# Altium project FC_small.PrjPcb
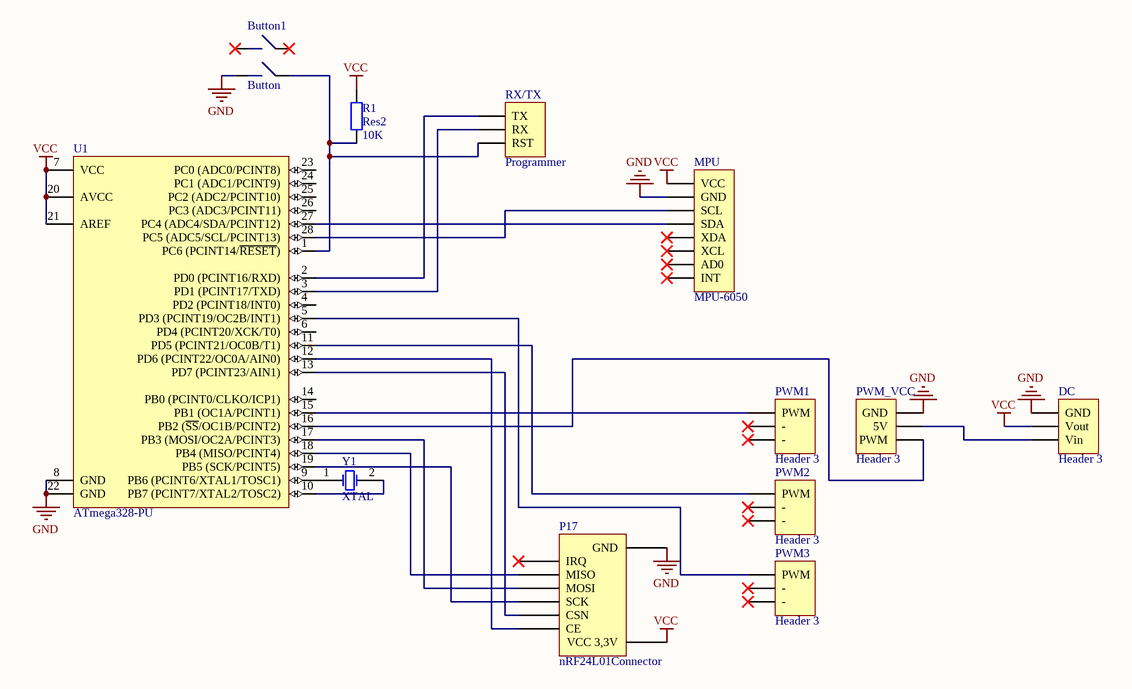
[diagram p0: FC_small.SchDoc]
1 sheet, 12 parts. Net scope: global (net labels, ports and power ports of the same name join across sheets).
Board file: PCB_FC_small.PcbDoc

## Sheet FC_small.SchDoc
size A4

### Parts
Button1  Button  [Button]
DC  Header 3  [HDR1X3]
MPU  MPU-6050  [HDR1X8]
P17  nRF24L01Connector  [HDR2X4]
PWM1  Header 3  [HDR1X3]
PWM2  Header 3  [HDR1X3]
PWM3  Header 3  [HDR1X3]
PWM_VCC  Header 3  [HDR1X3]
R1  Res2  value 10K  [AXIAL-0.4]
RX/TX  Programmer  [HDR1X3]
U1  ATmega328-PU  [28P3]
Y1  XTAL  [R38]

### Nets
GND: Button1.3 DC.1(GND) MPU.2(GND) P17.2(GND) PWM_VCC.3(GND) U1.8(GND) U1.22(GND)
VCC: DC.2(Vout) MPU.1(VCC) P17.1(VCC_3,3V) R1.2 U1.7(VCC) U1.20(AVCC) U1.21(AREF)
NetButton1_4: Button1.4 R1.1 RX/TX.3(RST) U1.1(PC6_(PCINT14/~{RESET}))
NetDC_3: DC.3(Vin) PWM_VCC.2(5V)
NetMPU_3: MPU.3(SCL) U1.28(PC5_(ADC5/SCL/PCINT13))
NetMPU_4: MPU.4(SDA) U1.27(PC4_(ADC4/SDA/PCINT12))
NetP17_3: P17.3(CE) U1.12(PD6_(PCINT22/OC0A/AIN0))
NetP17_4: P17.4(CSN) U1.13(PD7_(PCINT23/AIN1))
NetP17_5: P17.5(SCK) U1.19(PB5_(SCK/PCINT5))
NetP17_6: P17.6(MOSI) U1.17(PB3_(MOSI/OC2A/PCINT3))
NetP17_7: P17.7(MISO) U1.18(PB4_(MISO/PCINT4))
NetPWM1_1: PWM1.1(PWM) U1.15(PB1_(OC1A/PCINT1))
NetPWM2_1: PWM2.1(PWM) U1.11(PD5_(PCINT21/OC0B/T1))
NetPWM3_1: PWM3.1(PWM) U1.5(PD3_(PCINT19/OC2B/INT1))
NetPWM_VCC_1: PWM_VCC.1(PWM) U1.16(PB2_(~{SS}/OC1B/PCINT2))
NetRX/TX_1: RX/TX.1(TX) U1.2(PD0_(PCINT16/RXD))
NetRX/TX_2: RX/TX.2(RX) U1.3(PD1_(PCINT17/TXD))
NetU1_9: U1.9(PB6_(PCINT6/XTAL1/TOSC1)) Y1.1(OSC1)
NetU1_10: U1.10(PB7_(PCINT7/XTAL2/TOSC2)) Y1.2(OSC2)

Not connected (* = marked no-connect by the designer): Button1 1* 2*; MPU 5(XDA)* 6(XCL)* 7(AD0)* 8(INT)*; P17 8(IRQ)*; PWM1 2(-)* 3(-)*; PWM2 2(-)* 3(-)*; PWM3 2(-)* 3(-)*; U1 4(PD2_(PCINT18/INT0)) 6(PD4_(PCINT20/XCK/T0)) 14(PB0_(PCINT0/CLKO/ICP1)) 23(PC0_(ADC0/PCINT8)) 24(PC1_(ADC1/PCINT9)) 25(PC2_(ADC2/PCINT10)) 26(PC3_(ADC3/PCINT11))

### Library data of the parts
DC PWM1-PWM3 PWM_VCC RX/TX = Header 3: Header, 3-Pin; LatestRevisionDate: 17-Jul-2002; LatestRevisionNote: Re-released for DXP Platform.; Publisher: Altium Limited
MPU = Header 8: Header, 8-Pin; LatestRevisionDate: 17-Jul-2002; LatestRevisionNote: Re-released for DXP Platform.; Publisher: Altium Limited
R1 = Res2: Resistor; Published: 8-Jun-2000; LatestRevisionDate: 17-Jul-2002; LatestRevisionNote: Re-released for DXP Platform.; PackageReference: AXIAL-0.4; Publisher: Altium Limited; PackageDescription: Axial Device, Thru-Hole; 2 Leads; 0.4 in Pin Spacing
U1 = ATmega328-PU: 8-bit AVR Microcontroller, 32KB Flash, 1KB EEPROM, 2KB SRAM, 28-pin PDIP, Industrial Grade (-40°C to 85°C); Published: 1-Apr-2010; DatasheetVersion: revA, Jan-2010; PackageVersion: revB, Sep-2001; PackageReference: 28P3; Publisher: Altium Limited; PackageDescription: 28-lead (0.300"/7.62mm Wide) Plastic Dual Inline Package (PDIP); Supplier 1: Digi-Key; Supplier Part Number 1: ATMEGA328-PU-ND; Supplier 2: Mouser; Supplier Part Number 2: 556-ATMEGA328-PU; ComponentLink1Description: Manufacturer Link; ComponentLink1URL: http://www.atmel.com/products/avr/default.asp?; ComponentLink2Description: ATmega48A/48PA/88A/88PA/168A/168PA/328/328P Datasheet; ComponentLink2URL: http://www.atmel.com/dyn/resources/prod_documents/8271.pdf; ComponentLink3Description: ATmega48A/48PA/88A/88PA/168A/168PA/328/328P Summary; ComponentLink3URL: http://www.atmel.com/dyn/resources/prod_documents/8271S.pdf; ComponentLink4Description: Atmel.com Home; ComponentLink4URL: http://www.atmel.com
Y1 = XTAL: Crystal Oscillator; Published: 8-Jun-2000; LatestRevisionDate: 17-Jul-2002; LatestRevisionNote: Re-released for DXP Platform.; PackageReference: R38; Publisher: Altium Limited; PackageDescription: Crystal, Thru-Hole; 2 Leads; Body 3.1 x 8.2 mm (Dia.xH)